# EAGLE design smd-test-hot-air (EAGLE 6.4)
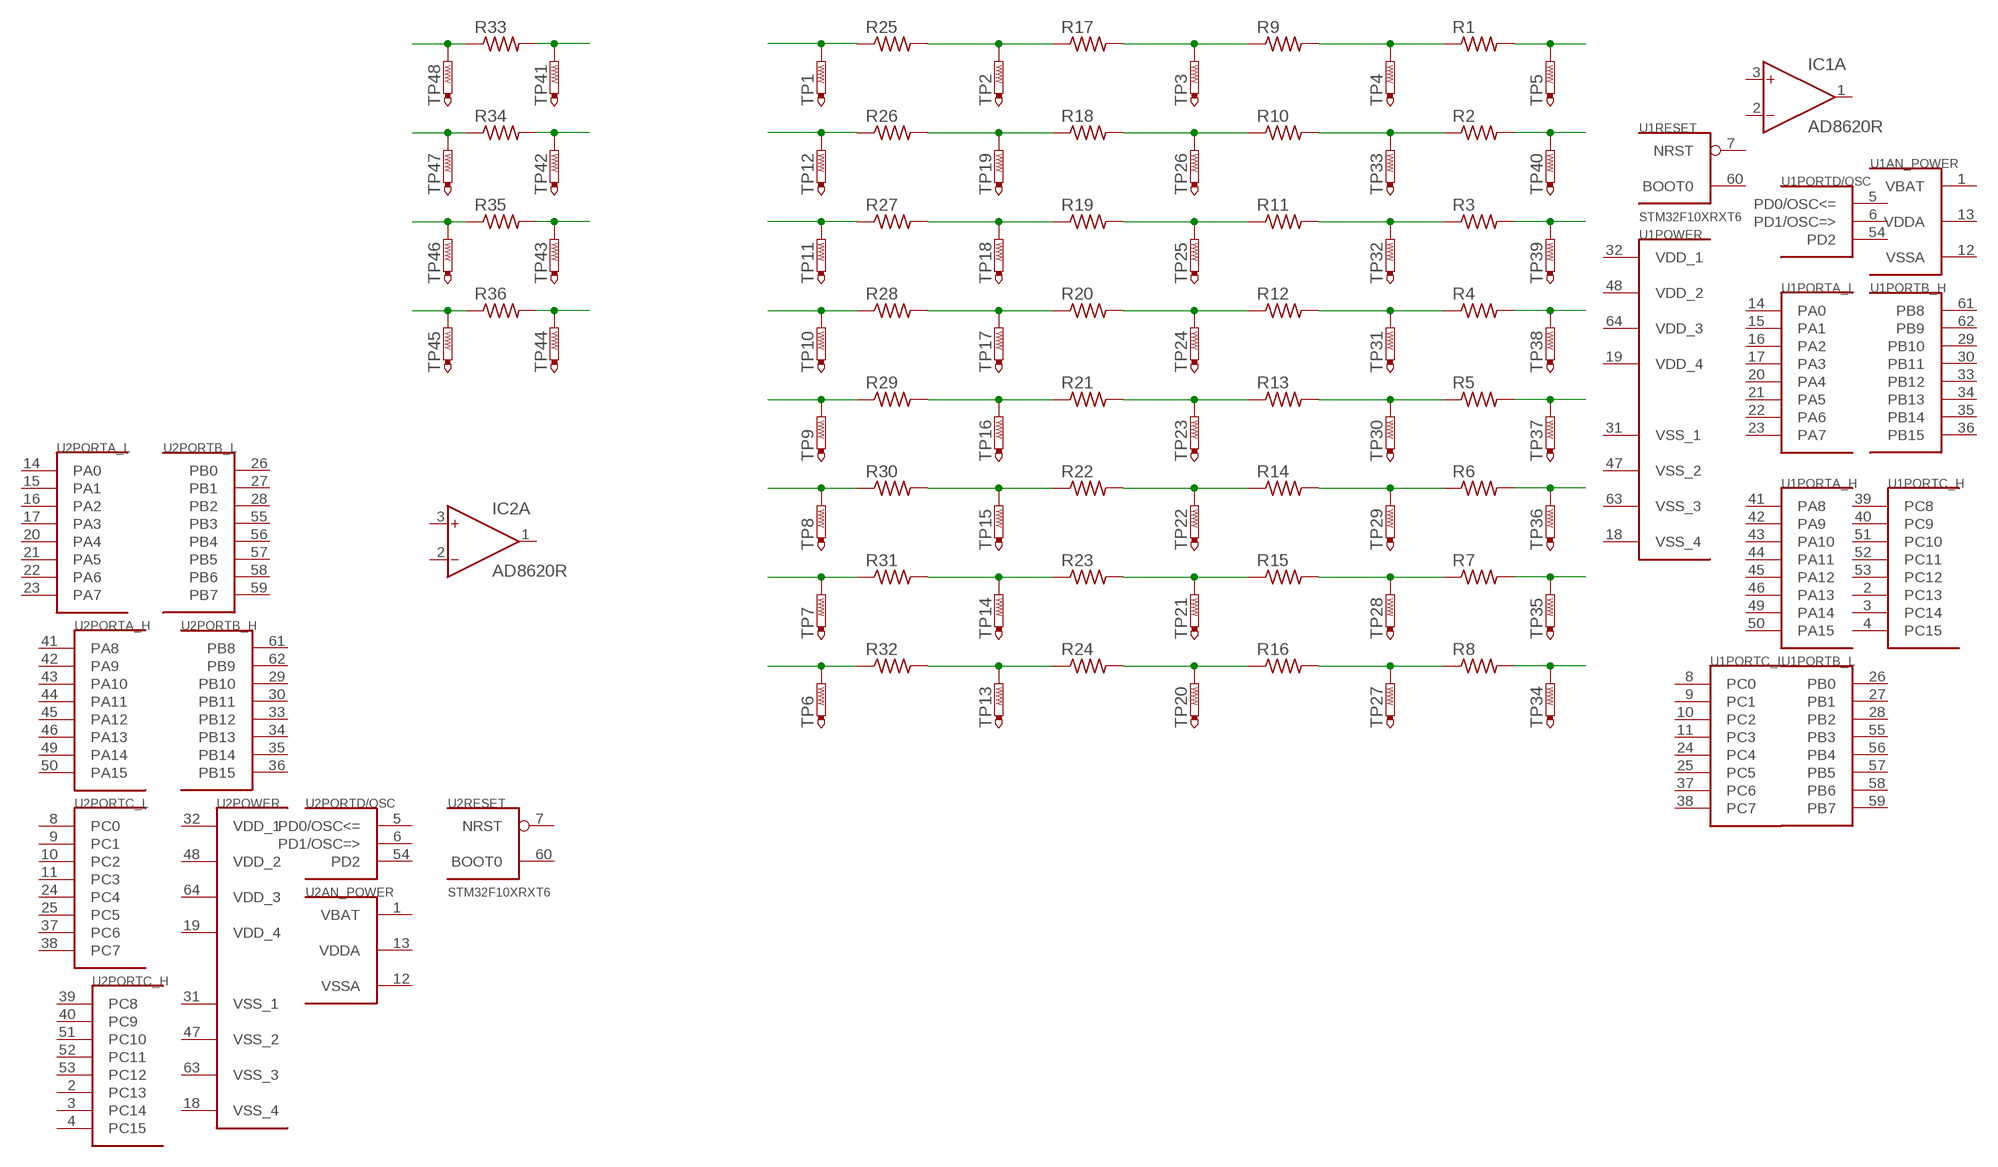
[diagram p0: schematic, sheet 1]

## Parts
IC1  AD8620R  [SO8]
IC2  AD8620R  [SO8]
R1  R-US_R0805  [R0805]
R2  R-US_R0805  [R0805]
R3  R-US_R0805  [R0805]
R4  R-US_R0805  [R0805]
R5  R-US_R0805  [R0805]
R6  R-US_R0805  [R0805]
R7  R-US_R0805  [R0805]
R8  R-US_R0805  [R0805]
R9  R-US_R0603  [R0603]
R10  R-US_R0603  [R0603]
R11  R-US_R0603  [R0603]
R12  R-US_R0603  [R0603]
R13  R-US_R0603  [R0603]
R14  R-US_R0603  [R0603]
R15  R-US_R0603  [R0603]
R16  R-US_R0603  [R0603]
R17  R-US_R0402  [R0402]
R18  R-US_R0402  [R0402]
R19  R-US_R0402  [R0402]
R20  R-US_R0402  [R0402]
R21  R-US_R0402  [R0402]
R22  R-US_R0402  [R0402]
R23  R-US_R0402  [R0402]
R24  R-US_R0402  [R0402]
R25  R-US_R0201  [R0201]
R26  R-US_R0201  [R0201]
R27  R-US_R0201  [R0201]
R28  R-US_R0201  [R0201]
R29  R-US_R0201  [R0201]
R30  R-US_R0201  [R0201]
R31  R-US_R0201  [R0201]
R32  R-US_R0201  [R0201]
R33  R-US_0204/7  [0204/7]
R34  R-US_0204/7  [0204/7]
R35  R-US_0204/7  [0204/7]
R36  R-US_0204/7  [0204/7]
TP1  PTR1TP11R  [TP11R]
TP2  PTR1TP11R  [TP11R]
TP3  PTR1TP11R  [TP11R]
TP4  PTR1TP11R  [TP11R]
TP5  PTR1TP11R  [TP11R]
TP6  PTR1TP11R  [TP11R]
TP7  PTR1TP11R  [TP11R]
TP8  PTR1TP11R  [TP11R]
TP9  PTR1TP11R  [TP11R]
TP10  PTR1TP11R  [TP11R]
TP11  PTR1TP11R  [TP11R]
TP12  PTR1TP11R  [TP11R]
TP13  PTR1TP11R  [TP11R]
TP14  PTR1TP11R  [TP11R]
TP15  PTR1TP11R  [TP11R]
TP16  PTR1TP11R  [TP11R]
TP17  PTR1TP11R  [TP11R]
TP18  PTR1TP11R  [TP11R]
TP19  PTR1TP11R  [TP11R]
TP20  PTR1TP11R  [TP11R]
TP21  PTR1TP11R  [TP11R]
TP22  PTR1TP11R  [TP11R]
TP23  PTR1TP11R  [TP11R]
TP24  PTR1TP11R  [TP11R]
TP25  PTR1TP11R  [TP11R]
TP26  PTR1TP11R  [TP11R]
TP27  PTR1TP11R  [TP11R]
TP28  PTR1TP11R  [TP11R]
TP29  PTR1TP11R  [TP11R]
TP30  PTR1TP11R  [TP11R]
TP31  PTR1TP11R  [TP11R]
TP32  PTR1TP11R  [TP11R]
TP33  PTR1TP11R  [TP11R]
TP34  PTR1TP11R  [TP11R]
TP35  PTR1TP11R  [TP11R]
TP36  PTR1TP11R  [TP11R]
TP37  PTR1TP11R  [TP11R]
TP38  PTR1TP11R  [TP11R]
TP39  PTR1TP11R  [TP11R]
TP40  PTR1TP11R  [TP11R]
TP41  PTR1TP11R  [TP11R]
TP42  PTR1TP11R  [TP11R]
TP43  PTR1TP11R  [TP11R]
TP44  PTR1TP11R  [TP11R]
TP45  PTR1TP11R  [TP11R]
TP46  PTR1TP11R  [TP11R]
TP47  PTR1TP11R  [TP11R]
TP48  PTR1TP11R  [TP11R]
U1  STM32F10XRXT6  [TQFP64]
U2  STM32F10XRXT6  [TQFP64]

## Nets
N$1: R17.1 R25.2 TP2.TP
N$2: R9.1 R17.2 TP3.TP
N$3: R1.1 R9.2 TP4.TP
N$4: R1.2 TP5.TP
N$5: R25.1 TP1.TP
N$6: R26.1 TP12.TP
N$7: R27.1 TP11.TP
N$8: R28.1 TP10.TP
N$9: R29.1 TP9.TP
N$10: R30.1 TP8.TP
N$11: R31.1 TP7.TP
N$12: R32.1 TP6.TP
N$13: R2.2 TP40.TP
N$14: R3.2 TP39.TP
N$15: R4.2 TP38.TP
N$16: R5.2 TP37.TP
N$17: R6.2 TP36.TP
N$18: R7.2 TP35.TP
N$19: R8.2 TP34.TP
N$20: R8.1 R16.2 TP27.TP
N$21: R7.1 R15.2 TP28.TP
N$22: R6.1 R14.2 TP29.TP
N$23: R5.1 R13.2 TP30.TP
N$24: R4.1 R12.2 TP31.TP
N$25: R3.1 R11.2 TP32.TP
N$26: R2.1 R10.2 TP33.TP
N$27: R10.1 R18.2 TP26.TP
N$28: R11.1 R19.2 TP25.TP
N$29: R12.1 R20.2 TP24.TP
N$30: R13.1 R21.2 TP23.TP
N$31: R14.1 R22.2 TP22.TP
N$32: R15.1 R23.2 TP21.TP
N$33: R16.1 R24.2 TP20.TP
N$34: R18.1 R26.2 TP19.TP
N$35: R19.1 R27.2 TP18.TP
N$36: R20.1 R28.2 TP17.TP
N$37: R21.1 R29.2 TP16.TP
N$38: R22.1 R30.2 TP15.TP
N$39: R23.1 R31.2 TP14.TP
N$40: R24.1 R32.2 TP13.TP
N$41: R33.2 TP41.TP
N$42: R34.2 TP42.TP
N$43: R35.2 TP43.TP
N$44: R36.2 TP44.TP
N$45: R33.1 TP48.TP
N$46: R34.1 TP47.TP
N$47: R35.1 TP46.TP
N$48: R36.1 TP45.TP
Unconnected: IC1.1(A:OUT) IC1.2(A:IN-) IC1.3(A:IN+) IC1.5(B:IN+) IC1.6(B:IN-) IC1.7(B:OUT) IC2.1(A:OUT) IC2.2(A:IN-) IC2.3(A:IN+) IC2.5(B:IN+) IC2.6(B:IN-) IC2.7(B:OUT) U1.2(PORTC_H:PC13) U1.3(PORTC_H:PC14) U1.4(PORTC_H:PC15) U1.5(PORTD/OSC:PD0/OSC<=) U1.6(PORTD/OSC:PD1/OSC=>) U1.7(RESET:NRST) U1.8(PORTC_L:PC0) U1.9(PORTC_L:PC1) U1.10(PORTC_L:PC2) U1.11(PORTC_L:PC3) U1.14(PORTA_L:PA0) U1.15(PORTA_L:PA1) U1.16(PORTA_L:PA2) U1.17(PORTA_L:PA3) U1.20(PORTA_L:PA4) U1.21(PORTA_L:PA5) U1.22(PORTA_L:PA6) U1.23(PORTA_L:PA7) U1.24(PORTC_L:PC4) U1.25(PORTC_L:PC5) U1.26(PORTB_L:PB0) U1.27(PORTB_L:PB1) U1.28(PORTB_L:PB2) U1.29(PORTB_H:PB10) U1.30(PORTB_H:PB11) U1.33(PORTB_H:PB12) U1.34(PORTB_H:PB13) U1.35(PORTB_H:PB14) U1.36(PORTB_H:PB15) U1.37(PORTC_L:PC6) U1.38(PORTC_L:PC7) U1.39(PORTC_H:PC8) U1.40(PORTC_H:PC9) U1.41(PORTA_H:PA8) U1.42(PORTA_H:PA9) U1.43(PORTA_H:PA10) U1.44(PORTA_H:PA11) U1.45(PORTA_H:PA12) U1.46(PORTA_H:PA13) U1.49(PORTA_H:PA14) U1.50(PORTA_H:PA15) U1.51(PORTC_H:PC10) U1.52(PORTC_H:PC11) U1.53(PORTC_H:PC12) U1.54(PORTD/OSC:PD2) U1.55(PORTB_L:PB3) U1.56(PORTB_L:PB4) U1.57(PORTB_L:PB5) U1.58(PORTB_L:PB6) U1.59(PORTB_L:PB7) U1.60(RESET:BOOT0) U1.61(PORTB_H:PB8) U1.62(PORTB_H:PB9) U2.2(PORTC_H:PC13) U2.3(PORTC_H:PC14) U2.4(PORTC_H:PC15) U2.5(PORTD/OSC:PD0/OSC<=) U2.6(PORTD/OSC:PD1/OSC=>) U2.7(RESET:NRST) U2.8(PORTC_L:PC0) U2.9(PORTC_L:PC1) U2.10(PORTC_L:PC2) U2.11(PORTC_L:PC3) U2.14(PORTA_L:PA0) U2.15(PORTA_L:PA1) U2.16(PORTA_L:PA2) U2.17(PORTA_L:PA3) U2.20(PORTA_L:PA4) U2.21(PORTA_L:PA5) U2.22(PORTA_L:PA6) U2.23(PORTA_L:PA7) U2.24(PORTC_L:PC4) U2.25(PORTC_L:PC5) U2.26(PORTB_L:PB0) U2.27(PORTB_L:PB1) U2.28(PORTB_L:PB2) U2.29(PORTB_H:PB10) U2.30(PORTB_H:PB11) U2.33(PORTB_H:PB12) U2.34(PORTB_H:PB13) U2.35(PORTB_H:PB14) U2.36(PORTB_H:PB15) U2.37(PORTC_L:PC6) U2.38(PORTC_L:PC7) U2.39(PORTC_H:PC8) U2.40(PORTC_H:PC9) U2.41(PORTA_H:PA8) U2.42(PORTA_H:PA9) U2.43(PORTA_H:PA10) U2.44(PORTA_H:PA11) U2.45(PORTA_H:PA12) U2.46(PORTA_H:PA13) U2.49(PORTA_H:PA14) U2.50(PORTA_H:PA15) U2.51(PORTC_H:PC10) U2.52(PORTC_H:PC11) U2.53(PORTC_H:PC12) U2.54(PORTD/OSC:PD2) U2.55(PORTB_L:PB3) U2.56(PORTB_L:PB4) U2.57(PORTB_L:PB5) U2.58(PORTB_L:PB6) U2.59(PORTB_L:PB7) U2.60(RESET:BOOT0) U2.61(PORTB_H:PB8) U2.62(PORTB_H:PB9)

## Power pins joined to a net without a drawn wire
V+: IC1.8(P:V+) IC2.8(P:V+)
V-: IC1.4(P:V-) IC2.4(P:V-)
VBAT: U1.1(AN_POWER:VBAT) U2.1(AN_POWER:VBAT)
VDD_1: U1.32(POWER:VDD_1) U2.32(POWER:VDD_1)
VDD_2: U1.48(POWER:VDD_2) U2.48(POWER:VDD_2)
VDD_3: U1.64(POWER:VDD_3) U2.64(POWER:VDD_3)
VDD_4: U1.19(POWER:VDD_4) U2.19(POWER:VDD_4)
VDDA: U1.13(AN_POWER:VDDA) U2.13(AN_POWER:VDDA)
VSS_1: U1.31(POWER:VSS_1) U2.31(POWER:VSS_1)
VSS_2: U1.47(POWER:VSS_2) U2.47(POWER:VSS_2)
VSS_3: U1.63(POWER:VSS_3) U2.63(POWER:VSS_3)
VSS_4: U1.18(POWER:VSS_4) U2.18(POWER:VSS_4)
VSSA: U1.12(AN_POWER:VSSA) U2.12(AN_POWER:VSSA)

## Library data of the parts
IC1 IC2 = analog-devices:AD8620: Precision, Very Low Noise, Low Input Bias Current, Wide Bandwidth JFET Operational Amplifiers Source: http://www.analog.com/static/imported-files/data_sheets/AD8610_8620.pdf; MF: ALTERA CORPORATION; MPN: AD8620ARZ; OC_FARNELL: 9994386; OC_NEWARK: 59K6972
R1-R36 = rcl:R-US_: RESISTOR, American symbol
TP1-TP48 = testpad:PTR1: TEST PIN
U1 U2 = stm32:STM32F10XRXT6: STM32F101/103 64pin LQFP

## Board
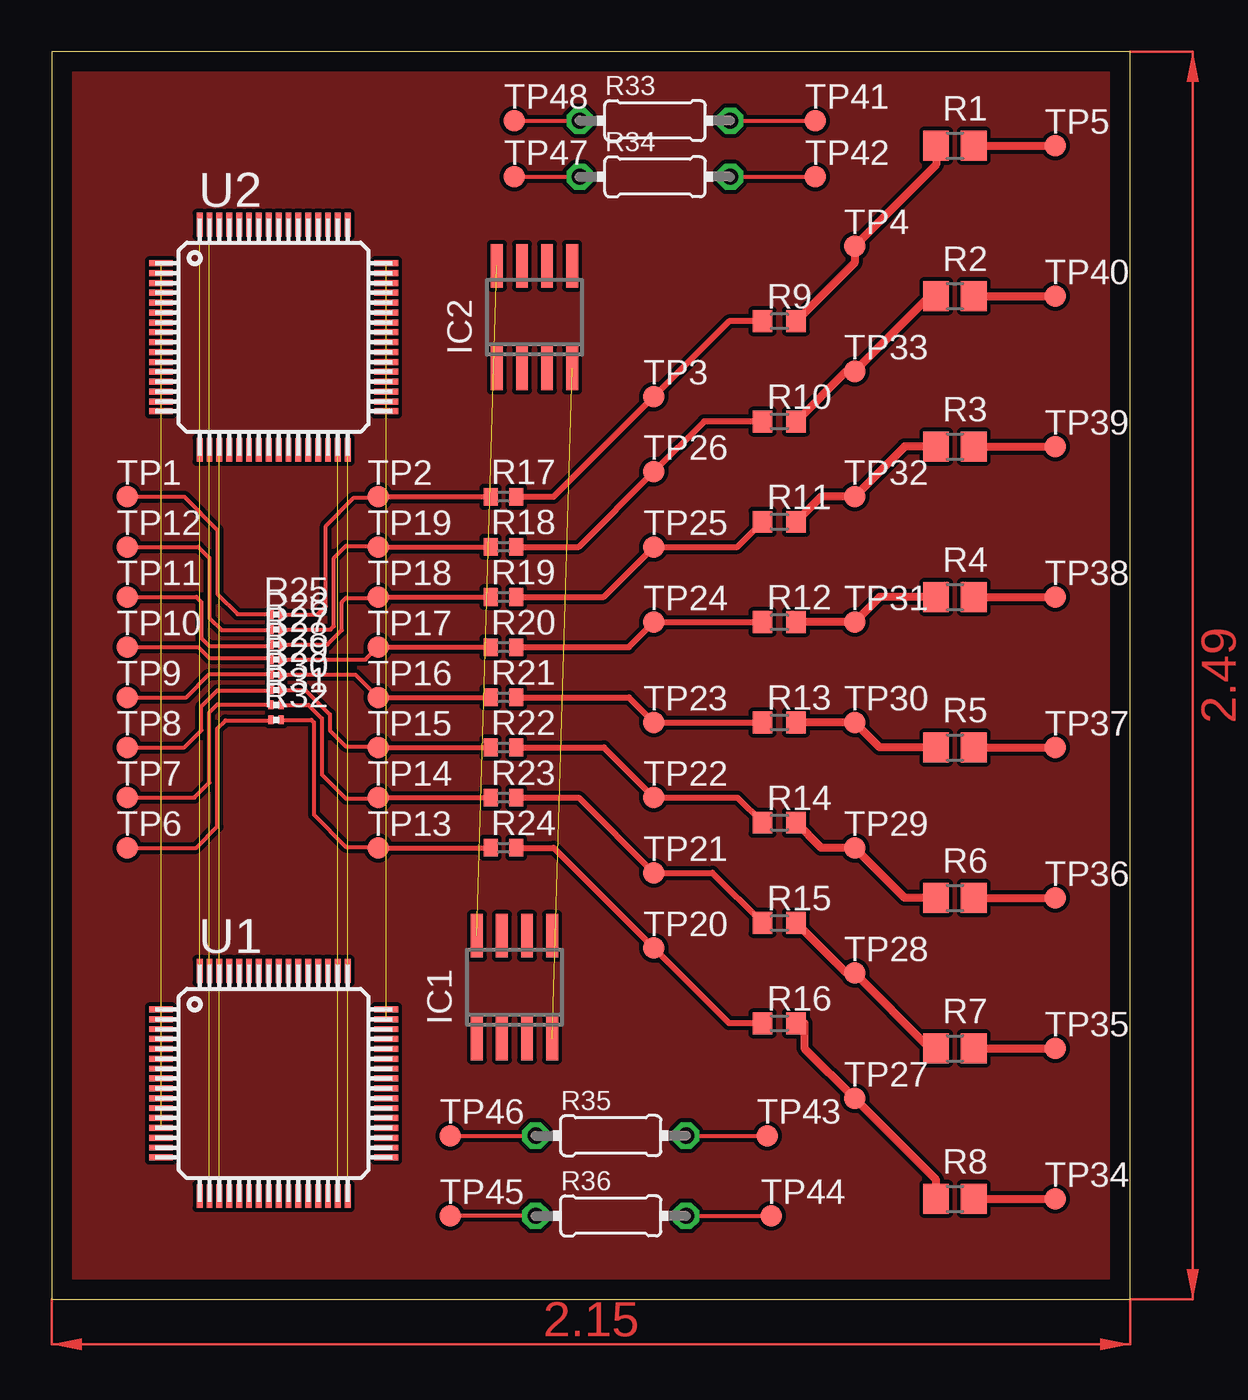
[diagram p1: board, top side]
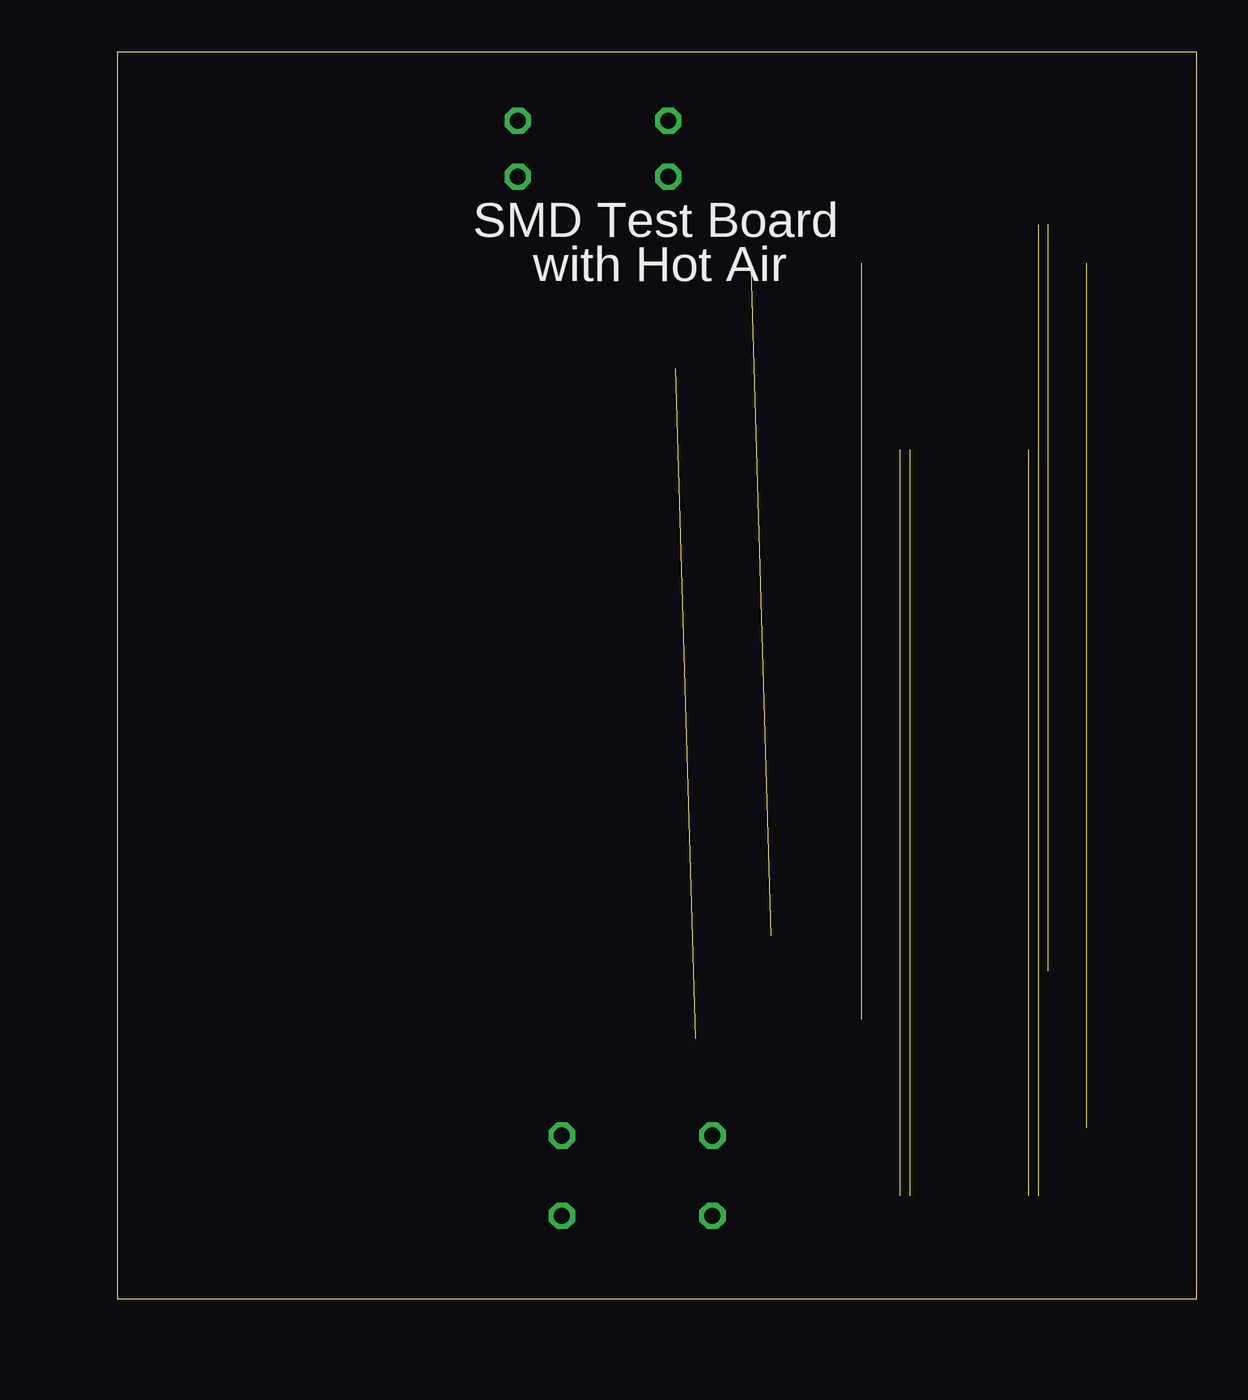
[diagram p2: board, bottom side, seen from below]

Size 54.59 x 63.17 mm. Coordinates in mm from the lower left corner, seen from the top.
Outline: 0,0 54.59,0 54.59,63.17 0,63.17 0,0
Copper layers (1*16): Top 0.035mm / dielectric 1.5mm / Bottom 0.035mm
Design rules "default": minimum track width 10mil, minimum drill 24mil, track to track 8mil, track to pad 8mil, pad to pad 8mil, via to via 8mil, smd to smd 8mil, copper to edge 40mil, drill to drill 8mil, minimum pad ring 10mil, minimum via ring 8mil, stop-mask expansion 4mil, vias tented up to drill 0mil, thermal gap 10mil

### Footprints (pad centres in the part's own frame; a part is rotated, then mirrored left to right if it is on the bottom)
SO8 = smd 0.6 x 2.2: 1 -1.905,-2.6; 2 -0.635,-2.6; 3 0.635,-2.6; 4 1.905,-2.6; 5 1.905,2.6; 6 0.635,2.6; 7 -0.635,2.6; 8 -1.905,2.6
R0805 = smd 1.3 x 1.5: 1 -0.95,0; 2 0.95,0
R0603 = smd 1 x 1.1: 1 -0.85,0; 2 0.85,0
R0402 = smd 0.7 x 0.9: 1 -0.65,0; 2 0.65,0
R0201 = smd 0.28 x 0.43: 1 -0.255,0; 2 0.255,0
0204/7 = drill 0.813 octagon: 1 -3.81,0; 2 3.81,0
TP11R = smd 1.1 x 1.1: TP 0,0
TQFP64 = smd 1.2 x 0.3: 1 -5.7,3.75; 2 -5.7,3.25; 3 -5.7,2.75; 4 -5.7,2.25; 5 -5.7,1.75; 6 -5.7,1.25; 7 -5.7,0.75; 8 -5.7,0.25; 9 -5.7,-0.25; 10 -5.7,-0.75; 11 -5.7,-1.25; 12 -5.7,-1.75; 13 -5.7,-2.25; 14 -5.7,-2.75; 15 -5.7,-3.25; 16 -5.7,-3.75; 33 5.7,-3.75; 34 5.7,-3.25; 35 5.7,-2.75; 36 5.7,-2.25; 37 5.7,-1.75; 38 5.7,-1.25; 39 5.7,-0.75; 40 5.7,-0.25; 41 5.7,0.25; 42 5.7,0.75; 43 5.7,1.25; 44 5.7,1.75; 45 5.7,2.25; 46 5.7,2.75; 47 5.7,3.25; 48 5.7,3.75 | smd 0.3 x 1.2: 17 -3.75,-5.7; 18 -3.25,-5.7; 19 -2.75,-5.7; 20 -2.25,-5.7; 21 -1.75,-5.7; 22 -1.25,-5.7; 23 -0.75,-5.7; 24 -0.25,-5.7; 25 0.25,-5.7; 26 0.75,-5.7; 27 1.25,-5.7; 28 1.75,-5.7; 29 2.25,-5.7; 30 2.75,-5.7; 31 3.25,-5.7; 32 3.75,-5.7; 49 3.75,5.7; 50 3.25,5.7; 51 2.75,5.7; 52 2.25,5.7; 53 1.75,5.7; 54 1.25,5.7; 55 0.75,5.7; 56 0.25,5.7; 57 -0.25,5.7; 58 -0.75,5.7; 59 -1.25,5.7; 60 -1.75,5.7; 61 -2.25,5.7; 62 -2.75,5.7; 63 -3.25,5.7; 64 -3.75,5.7

### Placement (x,y rotation side)
IC1  23.42,15.8 0 top
IC2  24.43,49.73 0 top
R1  45.72,58.42 0 top
R2  45.72,50.8 0 top
R3  45.72,43.18 0 top
R4  45.72,35.56 0 top
R5  45.72,27.94 0 top
R6  45.72,20.32 0 top
R7  45.72,12.7 0 top
R8  45.72,5.08 0 top
R9  36.83,49.53 0 top
R10  36.83,44.45 0 top
R11  36.83,39.37 0 top
R12  36.83,34.29 0 top
R13  36.83,29.21 0 top
R14  36.83,24.13 0 top
R15  36.83,19.05 0 top
R16  36.83,13.97 0 top
R17  22.86,40.64 0 top
R18  22.86,38.1 0 top
R19  22.86,35.56 0 top
R20  22.86,33.02 0 top
R21  22.86,30.48 0 top
R22  22.86,27.94 0 top
R23  22.86,25.4 0 top
R24  22.86,22.86 0 top
R25  11.35,34.67 0 top
R26  11.35,33.91 0 top
R27  11.35,33.15 0 top
R28  11.35,32.39 0 top
R29  11.35,31.62 0 top
R30  11.35,30.86 0 top
R31  11.35,30.1 0 top
R32  11.35,29.34 0 top
R33  30.53,59.69 0 top
R34  30.53,56.85 0 top
R35  28.3,8.28 0 top
R36  28.3,4.22 0 top
TP1  3.81,40.64 0 top
TP2  16.51,40.64 0 top
TP3  30.48,45.72 0 top
TP4  40.64,53.34 0 top
TP5  50.8,58.42 0 top
TP6  3.81,22.86 0 top
TP7  3.81,25.4 0 top
TP8  3.81,27.94 0 top
TP9  3.81,30.48 0 top
TP10  3.81,33.02 0 top
TP11  3.81,35.56 0 top
TP12  3.81,38.1 0 top
TP13  16.51,22.86 0 top
TP14  16.51,25.4 0 top
TP15  16.51,27.94 0 top
TP16  16.51,30.48 0 top
TP17  16.51,33.02 0 top
TP18  16.51,35.56 0 top
TP19  16.51,38.1 0 top
TP20  30.48,17.78 0 top
TP21  30.48,21.59 0 top
TP22  30.48,25.4 0 top
TP23  30.48,29.21 0 top
TP24  30.48,34.29 0 top
TP25  30.48,38.1 0 top
TP26  30.48,41.91 0 top
TP27  40.64,10.16 0 top
TP28  40.64,16.51 0 top
TP29  40.64,22.86 0 top
TP30  40.64,29.21 0 top
TP31  40.64,34.29 0 top
TP32  40.64,40.64 0 top
TP33  40.64,46.99 0 top
TP34  50.8,5.08 0 top
TP35  50.8,12.7 0 top
TP36  50.8,20.32 0 top
TP37  50.8,27.94 0 top
TP38  50.8,35.56 0 top
TP39  50.8,43.18 0 top
TP40  50.8,50.8 0 top
TP41  38.66,59.69 0 top
TP42  38.66,56.85 0 top
TP43  36.22,8.28 0 top
TP44  36.42,4.22 0 top
TP45  20.17,4.22 0 top
TP46  20.17,8.28 0 top
TP47  23.42,56.85 0 top
TP48  23.42,59.69 0 top
U1  11.23,10.92 0 top
U2  11.23,48.72 0 top

### Tracks (layer width: path | path; a pad name or v marks a point on that pad's centre or on a via)
N$1
  Top 0.203: R25.2 13.44,34.67 13.87,35.1 13.87,39.17 15.29,40.59 16.46,40.59 TP2.TP
  Top 0.254: TP2.TP R17.1
N$2
  Top 0.305: R9.1 34.29,49.53 TP3.TP 25.4,40.64 R17.2
N$3
  Top 0.406: R1.1 44.77,57.47 TP4.TP 40.64,52.49 R9.2
N$4
  Top 0.406: R1.2 TP5.TP
N$5
  Top 0.203: TP1.TP 6.71,40.64 8.38,38.96 8.38,35.71 9.4,34.7 11.07,34.7 R25.1
N$6
  Top 0.203: TP12.TP 7.42,38.1 7.98,37.54 7.98,34.49 8.59,33.88 11.07,33.88 R26.1
N$7
  Top 0.203: TP11.TP 7.31,35.56 7.57,35.31 7.57,33.48 7.98,33.07 11.02,33.07 R27.1
N$8
  Top 0.203: TP10.TP 7.42,33.02 7.98,32.46 11.02,32.46 R28.1
N$9
  Top 0.203: TP9.TP 6.81,30.48 7.98,31.65 11.07,31.65 R29.1
N$10
  Top 0.203: TP8.TP 6.71,27.94 7.57,28.8 7.57,30.02 8.38,30.84 11.07,30.84 R30.1
N$11
  Top 0.203: TP7.TP 7.21,25.4 7.98,26.16 7.98,29.72 8.38,30.12 11.07,30.12 R31.1
N$12
  Top 0.203: TP6.TP 7.31,22.86 8.38,23.93 8.38,28.91 8.79,29.31 11.07,29.31 R32.1
N$13
  Top 0.406: R2.2 TP40.TP
N$14
  Top 0.406: R3.2 TP39.TP
N$15
  Top 0.406: R4.2 TP38.TP
N$16
  Top 0.406: R5.2 TP37.TP
N$17
  Top 0.406: R6.2 TP36.TP
N$18
  Top 0.406: R7.2 TP35.TP
N$19
  Top 0.406: R8.2 TP34.TP
N$20
  Top 0.406: R8.1 44.77,6.03 TP27.TP 38.1,12.7 38.1,13.97 R16.2
N$21
  Top 0.406: R7.1 44.45,12.7 TP28.TP 40.22,16.51 R15.2
N$22
  Top 0.406: R6.1 43.18,20.32 TP29.TP 38.95,22.86 R14.2
N$23
  Top 0.406: R5.1 41.91,27.94 TP30.TP R13.2
N$24
  Top 0.406: R4.1 41.91,35.56 TP31.TP R12.2
N$25
  Top 0.406: R3.1 43.18,43.18 TP32.TP 38.95,40.64 R11.2
N$26
  Top 0.406: R2.1 44.45,50.8 TP33.TP 40.22,46.99 R10.2
N$27
  Top 0.305: R10.1 33.02,44.45 TP26.TP 26.67,38.1 R18.2
N$28
  Top 0.305: R11.1 34.71,38.1 TP25.TP 27.94,35.56 R19.2
N$29
  Top 0.305: R12.1 TP24.TP 29.21,33.02 R20.2
N$30
  Top 0.305: R13.1 TP23.TP 29.21,30.48 R21.2
N$31
  Top 0.305: R14.1 34.71,25.4 TP22.TP 27.94,27.94 R22.2
N$32
  Top 0.305: R15.1 33.44,21.59 TP21.TP 26.67,25.4 R23.2
N$33
  Top 0.305: R16.1 34.29,13.97 TP20.TP 25.4,22.86 R24.2
N$34
  Top 0.203: R26.2 14.1,33.91 14.28,34.09 14.28,37.54 14.88,38.15 16.46,38.15 TP19.TP
  Top 0.254: TP19.TP R18.1
N$35
  Top 0.203: R27.2 13.95,33.15 14.68,33.88 14.68,35.31 14.88,35.51 16.46,35.51 TP18.TP
  Top 0.254: TP18.TP R19.1
N$36
  Top 0.203: R28.2 15.88,32.39 TP17.TP
  Top 0.254: TP17.TP R20.1
N$37
  Top 0.203: R29.2 15.37,31.62 TP16.TP
  Top 0.254: TP16.TP R21.1
N$38
  Top 0.203: R30.2 12.83,30.86 14.07,29.62 14.07,28.8 14.88,27.99 16.46,27.99 TP15.TP
  Top 0.254: TP15.TP R22.1
N$39
  Top 0.203: R31.2 12.98,30.1 13.67,29.41 13.67,26.57 14.88,25.35 16.46,25.35 TP14.TP
  Top 0.254: TP14.TP R23.1
N$40
  Top 0.203: R32.2 13.13,29.34 13.26,29.21 13.26,24.54 14.88,22.91 16.46,22.91 TP13.TP
  Top 0.254: TP13.TP R24.1
N$41
  Top 0.203: R33.2 TP41.TP
N$42
  Top 0.203: R34.2 TP42.TP
N$43
  Top 0.203: R35.2 TP43.TP
N$44
  Top 0.203: R36.2 TP44.TP
N$45
  Top 0.203: TP48.TP R33.1
N$46
  Top 0.203: TP47.TP R34.1
N$47
  Top 0.203: TP46.TP R35.1
N$48
  Top 0.203: R36.1 TP45.TP
N$49
  pour Top: 0.46,62.74 54.1,62.74 54.1,0.36 0.46,0.36
V+  (1 unrouted)
V-  (1 unrouted)
VBAT  (1 unrouted)
VDD_1  (1 unrouted)
VDD_2  (1 unrouted)
VDD_3  (1 unrouted)
VDD_4  (1 unrouted)
VDDA  (1 unrouted)
VSS_1  (1 unrouted)
VSS_2  (1 unrouted)
VSS_3  (1 unrouted)
VSS_4  (1 unrouted)
VSSA  (1 unrouted)
(copper drawn outside any net)
  shapes: Top area x2

### Text on the board
bPlace: SMD Test Board | with Hot Air